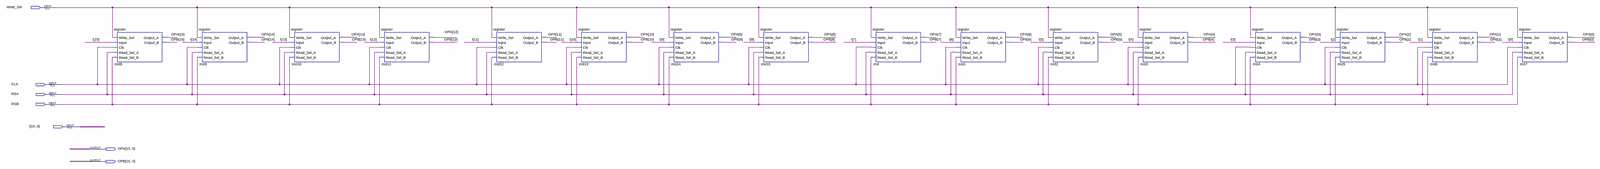
[diagram p0: schematic sheet, whole]
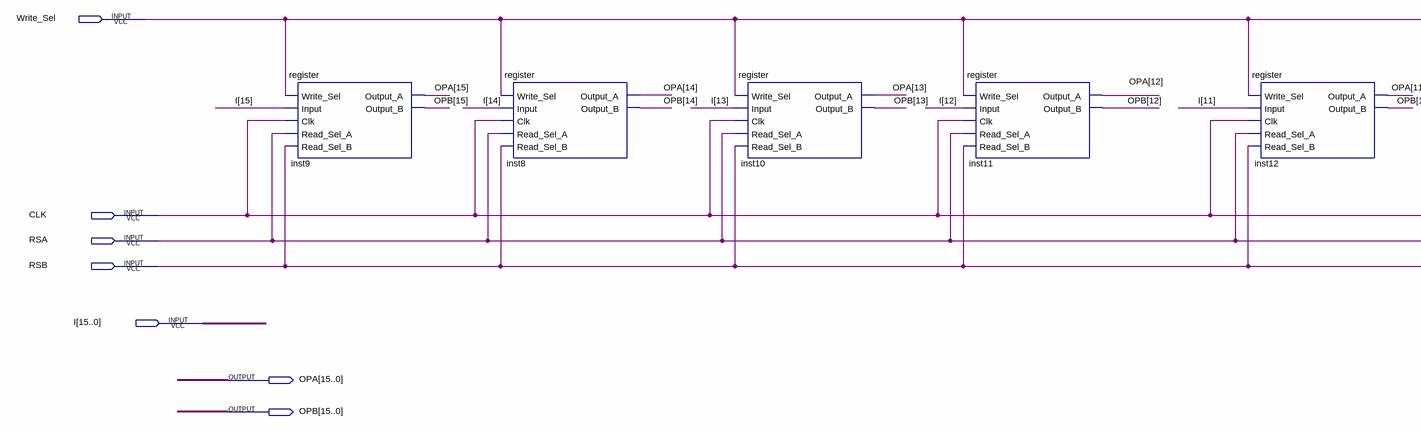
[diagram p1: schematic sheet, left part]
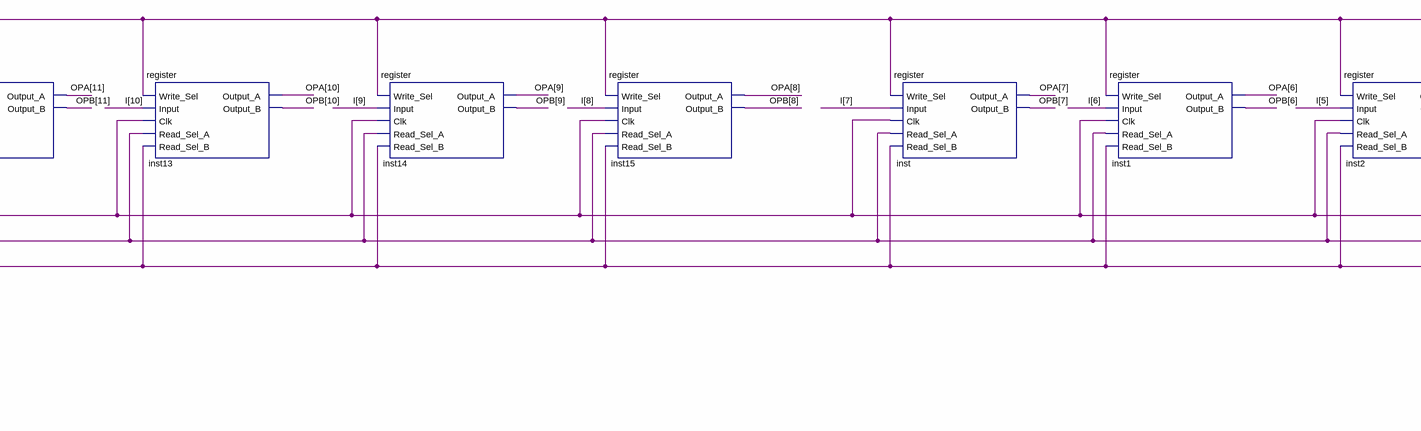
[diagram p2: schematic sheet, centre part]
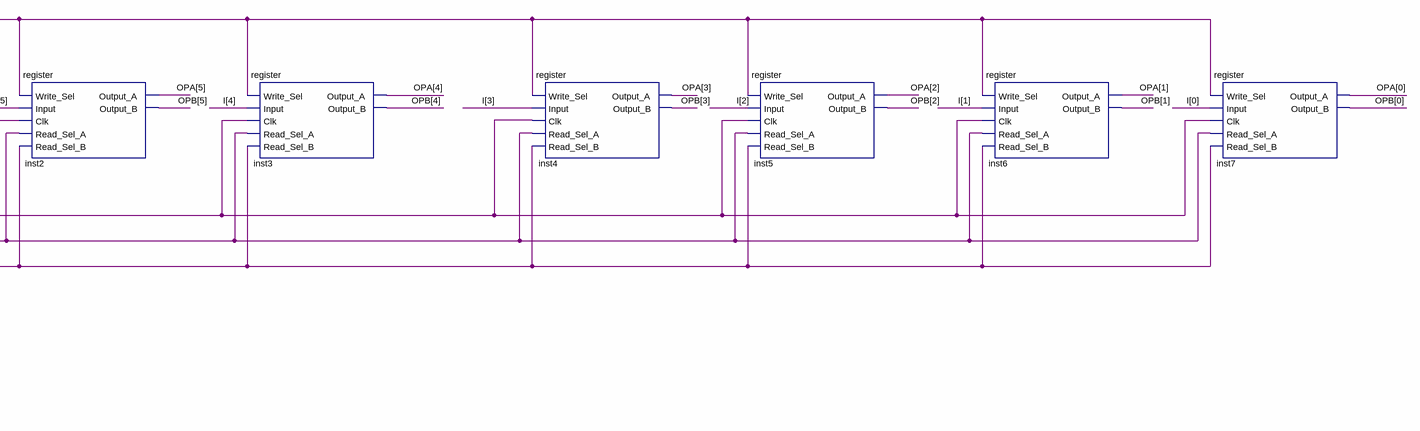
[diagram p3: schematic sheet, right part]
// Quartus schematic register_2.bdf as structural Verilog: 16 symbols, 7 pins
module register_2 (
  input  Write_Sel,
  input  CLK,
  input  RSA,
  input  RSB,
  input  [15:0] I,
  output [15:0] OPA,
  output [15:0] OPB
);

  register inst9 (
    .Write_Sel(Write_Sel), .Input(I[15]), .Clk(CLK), .Read_Sel_A(RSA), .Read_Sel_B(RSB), .Output_A(OPA[15]),
    .Output_B(OPB[15]));
  register inst8 (
    .Write_Sel(Write_Sel), .Input(I[14]), .Clk(CLK), .Read_Sel_A(RSA), .Read_Sel_B(RSB), .Output_A(OPA[14]),
    .Output_B(OPB[14]));
  register inst10 (
    .Write_Sel(Write_Sel), .Input(I[13]), .Clk(CLK), .Read_Sel_A(RSA), .Read_Sel_B(RSB), .Output_A(OPA[13]),
    .Output_B(OPB[13]));
  register inst11 (
    .Write_Sel(Write_Sel), .Input(I[12]), .Clk(CLK), .Read_Sel_A(RSA), .Read_Sel_B(RSB), .Output_A(OPA[12]),
    .Output_B(OPB[12]));
  register inst12 (
    .Write_Sel(Write_Sel), .Input(I[11]), .Clk(CLK), .Read_Sel_A(RSA), .Read_Sel_B(RSB), .Output_A(OPA[11]),
    .Output_B(OPB[11]));
  register inst13 (
    .Write_Sel(Write_Sel), .Input(I[10]), .Clk(CLK), .Read_Sel_A(RSA), .Read_Sel_B(RSB), .Output_A(OPA[10]),
    .Output_B(OPB[10]));
  register inst14 (
    .Write_Sel(Write_Sel), .Input(I[9]), .Clk(CLK), .Read_Sel_A(RSA), .Read_Sel_B(RSB), .Output_A(OPA[9]),
    .Output_B(OPB[9]));
  register inst15 (
    .Write_Sel(Write_Sel), .Input(I[8]), .Clk(CLK), .Read_Sel_A(RSA), .Read_Sel_B(RSB), .Output_A(OPA[8]),
    .Output_B(OPB[8]));
  register inst (
    .Write_Sel(Write_Sel), .Input(I[7]), .Clk(CLK), .Read_Sel_A(RSA), .Read_Sel_B(RSB), .Output_A(OPA[7]),
    .Output_B(OPB[7]));
  register inst1 (
    .Write_Sel(Write_Sel), .Input(I[6]), .Clk(CLK), .Read_Sel_A(RSA), .Read_Sel_B(RSB), .Output_A(OPA[6]),
    .Output_B(OPB[6]));
  register inst2 (
    .Write_Sel(Write_Sel), .Input(I[5]), .Clk(CLK), .Read_Sel_A(RSA), .Read_Sel_B(RSB), .Output_A(OPA[5]),
    .Output_B(OPB[5]));
  register inst3 (
    .Write_Sel(Write_Sel), .Input(I[4]), .Clk(CLK), .Read_Sel_A(RSA), .Read_Sel_B(RSB), .Output_A(OPA[4]),
    .Output_B(OPB[4]));
  register inst4 (
    .Write_Sel(Write_Sel), .Input(I[3]), .Clk(CLK), .Read_Sel_A(RSA), .Read_Sel_B(RSB), .Output_A(OPA[3]),
    .Output_B(OPB[3]));
  register inst5 (
    .Write_Sel(Write_Sel), .Input(I[2]), .Clk(CLK), .Read_Sel_A(RSA), .Read_Sel_B(RSB), .Output_A(OPA[2]),
    .Output_B(OPB[2]));
  register inst6 (
    .Write_Sel(Write_Sel), .Input(I[1]), .Clk(CLK), .Read_Sel_A(RSA), .Read_Sel_B(RSB), .Output_A(OPA[1]),
    .Output_B(OPB[1]));
  register inst7 (
    .Write_Sel(Write_Sel), .Input(I[0]), .Clk(CLK), .Read_Sel_A(RSA), .Read_Sel_B(RSB), .Output_A(OPA[0]),
    .Output_B(OPB[0]));
endmodule
